# EAGLE design MonitorWizard-Logger (EAGLE 6.6.0)
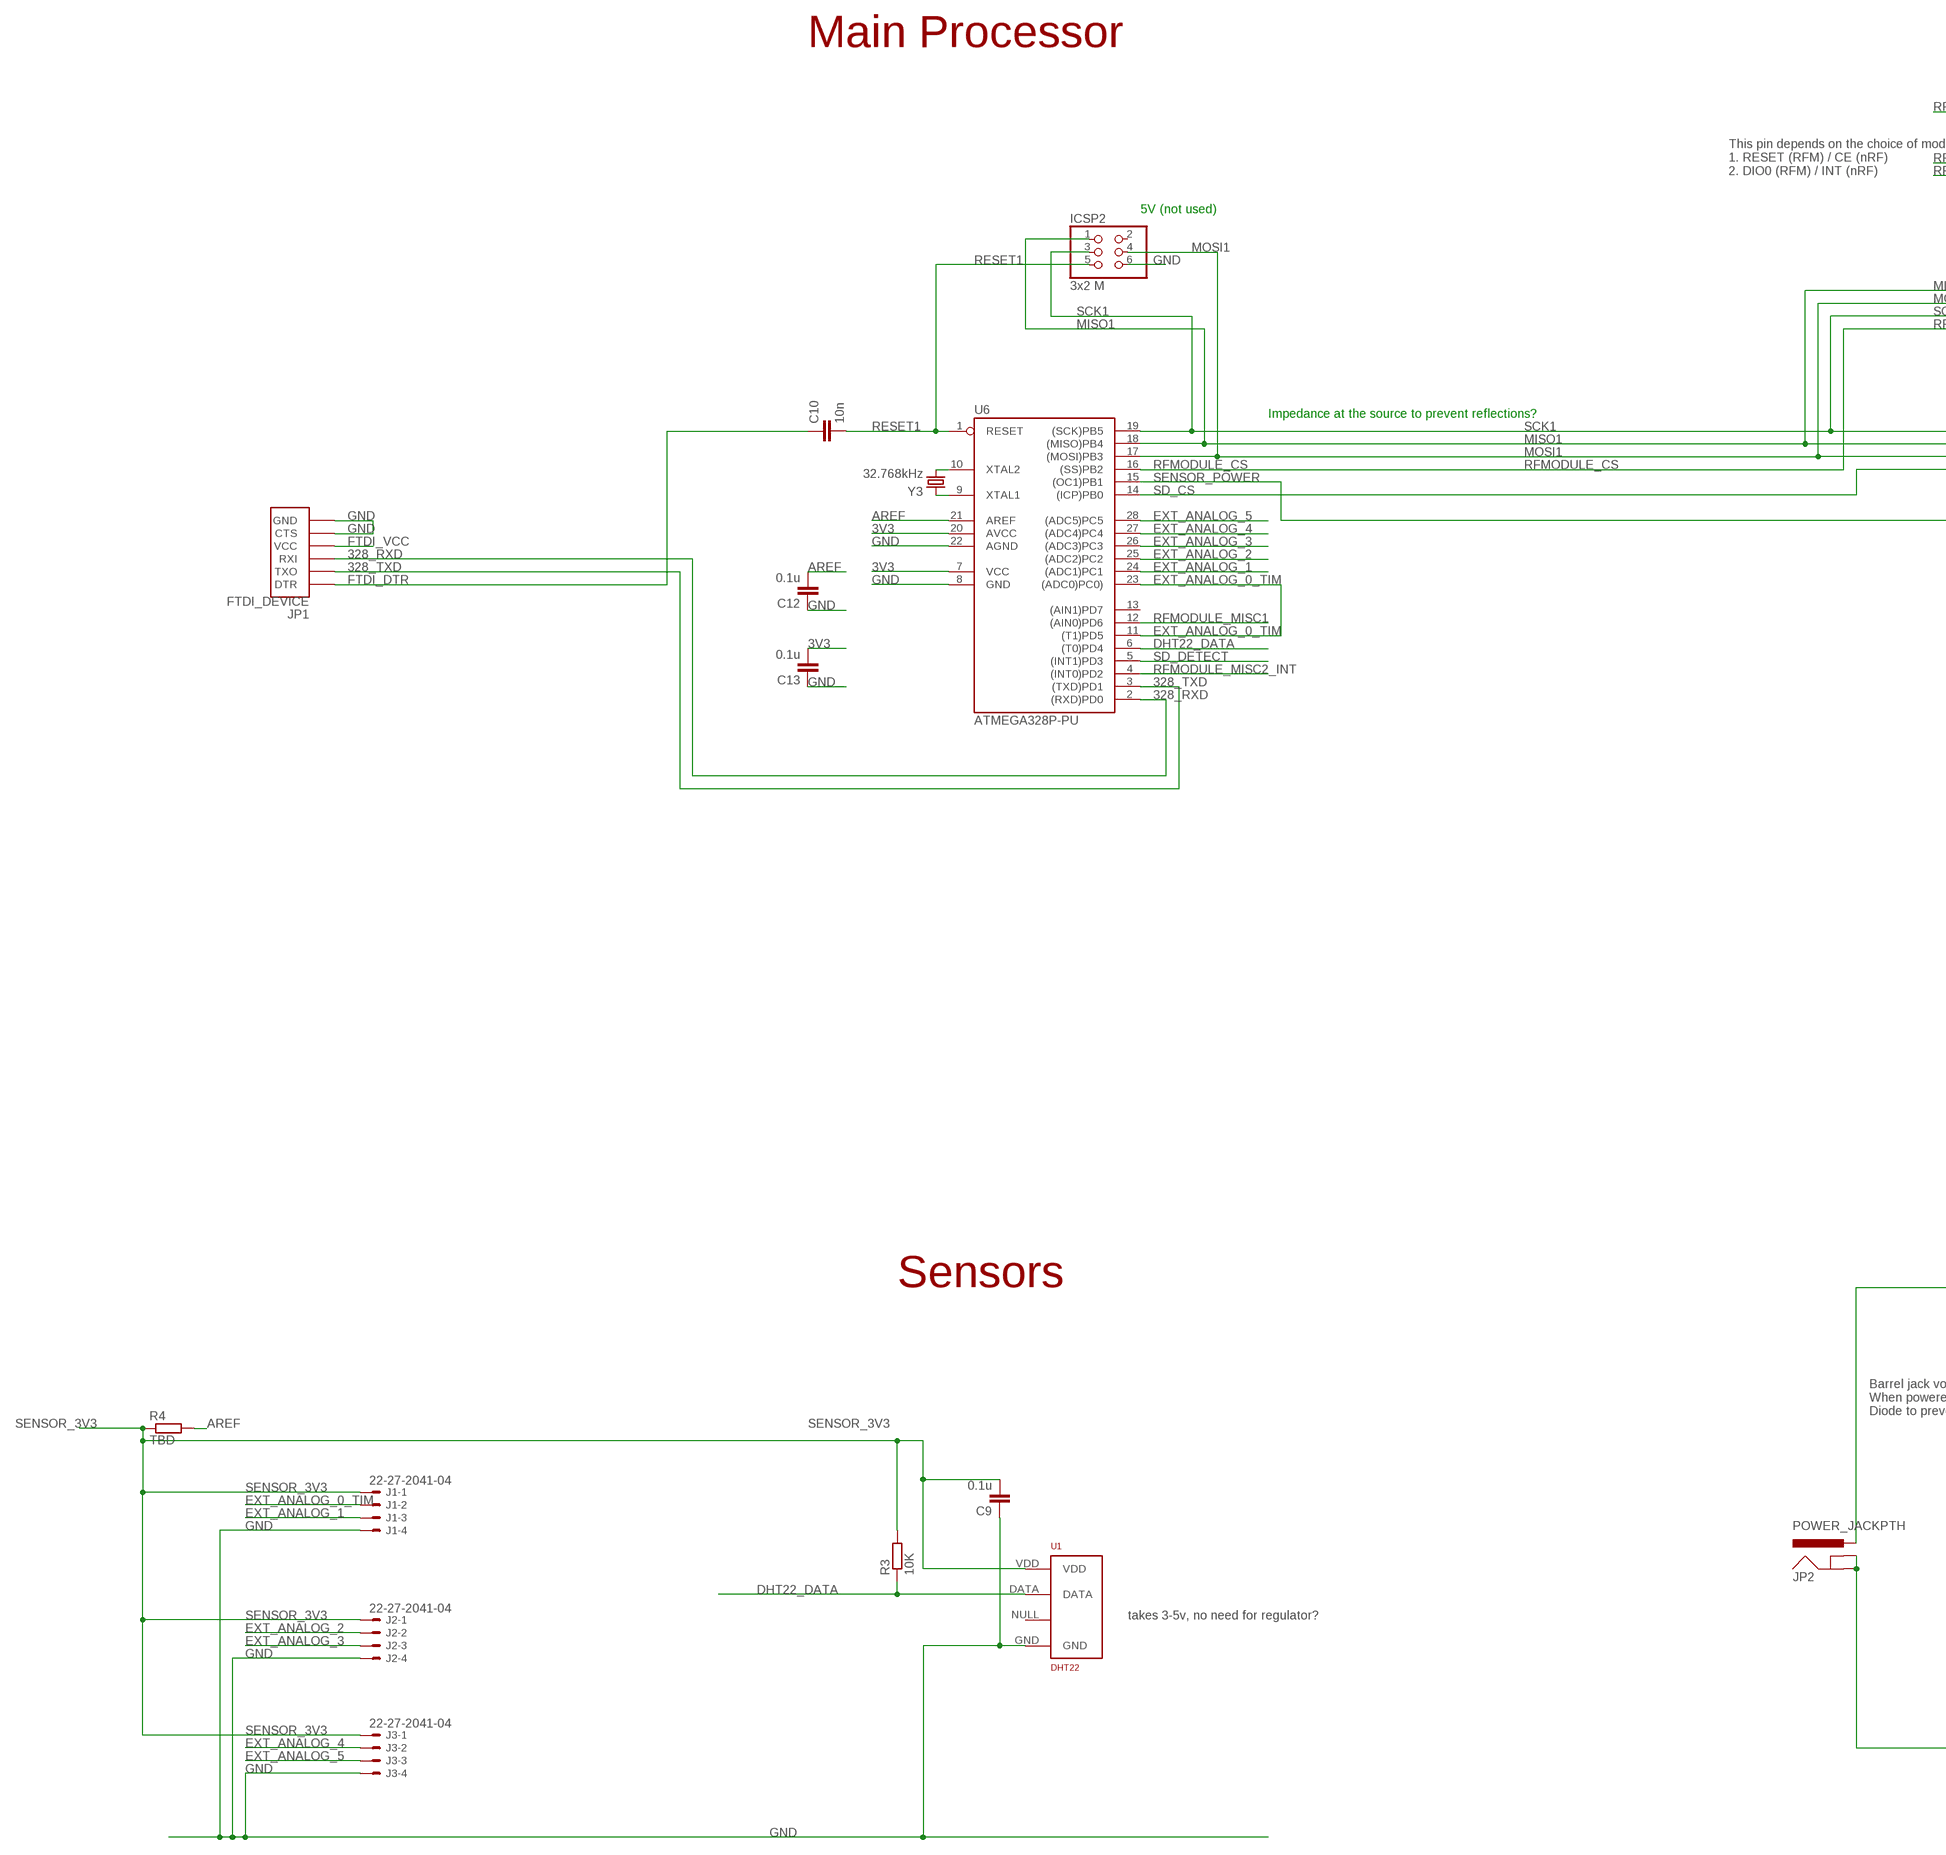
[diagram p0: schematic, sheet 1, part 1 of 2]
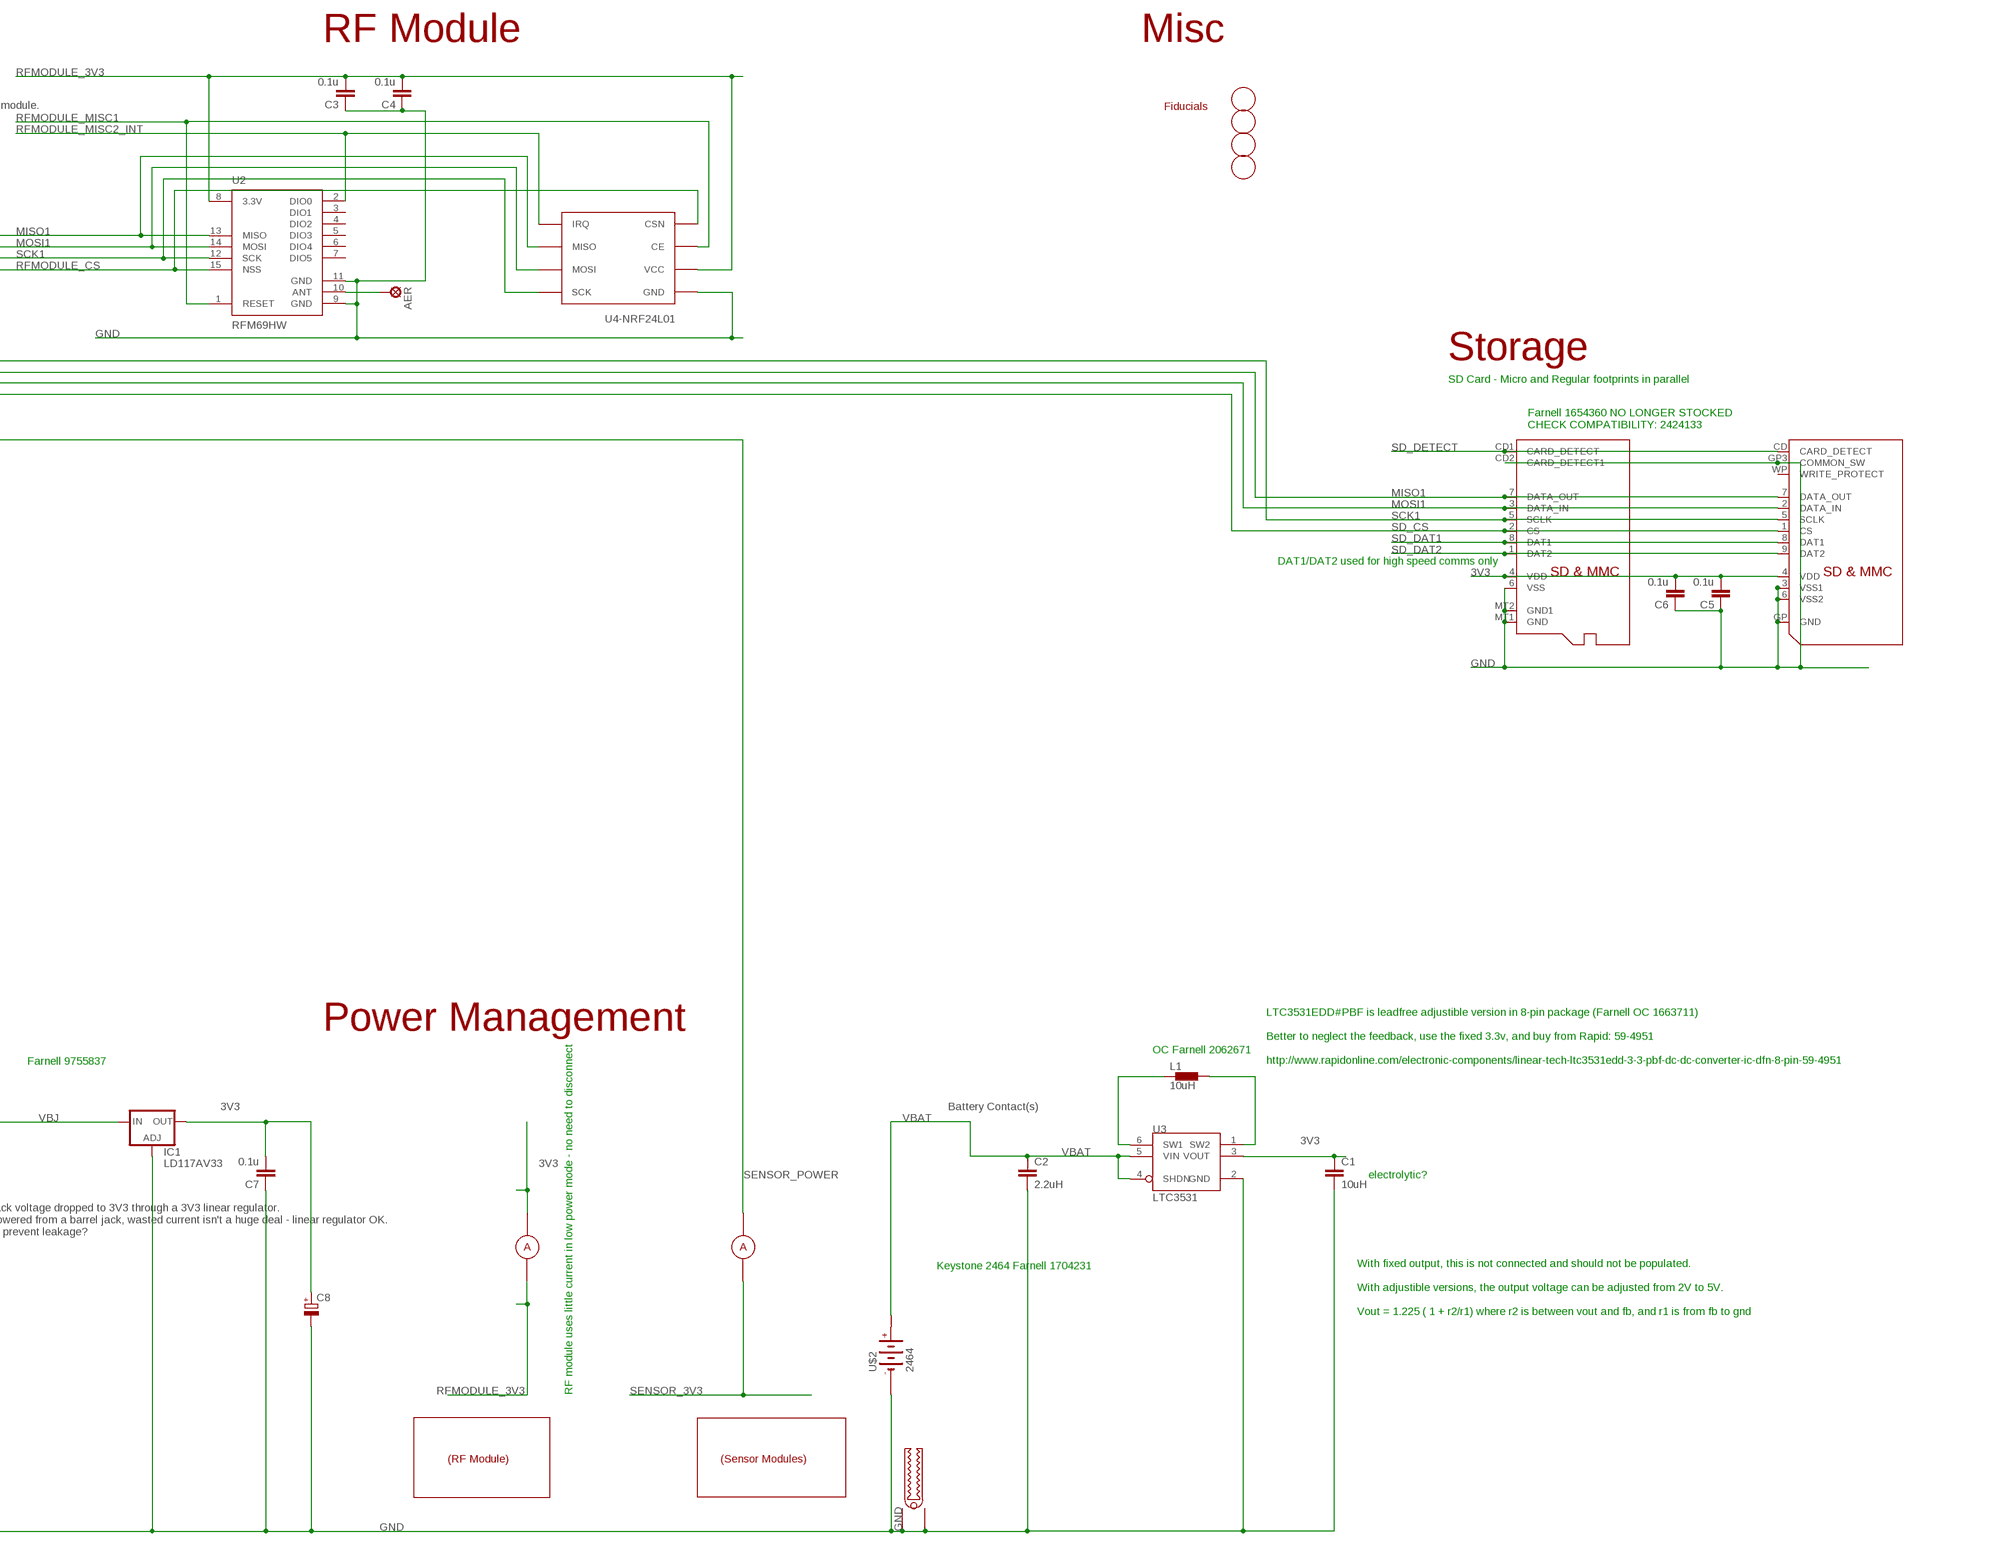
[diagram p1: schematic, sheet 1, part 2 of 2]

## Parts
AER  LSP10  [LSP10]
C1  10uH  C-EU025-024X044  [C025-024X044]
C2  2.2uH  C-EU025-024X044  [C025-024X044]
C3  0.1u  C-EU025-024X044  [C025-024X044]
C4  0.1u  C-EU025-024X044  [C025-024X044]
C5  0.1u  C-EU025-024X044  [C025-024X044]
C6  0.1u  C-EU025-024X044  [C025-024X044]
C7  0.1u  C-EU025-024X044  [C025-024X044]
C8  CPOL-EUE2.5-6  [E2,5-6]
C9  0.1u  C-EU025-024X044  [C025-024X044]
C10  10n  C-EU025-024X044  [C025-024X044]
C12  0.1u  C-EU025-024X044  [C025-024X044]
C13  0.1u  C-EU025-024X044  [C025-024X044]
CON1  MICROSD  [MICROSD]
FD1  FIDUCIALMOUNT  [FIDUCIA-MOUNT]
FD2  FIDUCIALMOUNT  [FIDUCIA-MOUNT]
FD3  FIDUCIALMOUNT  [FIDUCIA-MOUNT]
FD4  FIDUCIALMOUNT  [FIDUCIA-MOUNT]
GND  ALLIGATOR  [ALLIGATOR]
I_RF  CURRENT_MEASURE_0.4A  [CURRENT_MEASURE]
I_SENSE  CURRENT_MEASURE_0.4A  [CURRENT_MEASURE]
IC1  LD117AV33  [TO220L1]
ICSP2  3x2 M  PINHD-2X3  [2X03]
J1  22-27-2041-04  [6410-04]
J2  22-27-2041-04  [6410-04]
J3  22-27-2041-04  [6410-04]
JP1  FTDI_DEVICE  [FTDI_DEVICE_SIDE]
JP2  POWER_JACKPTH  [POWER_JACK_PTH]
L1  10uH  MURATA-1100R  [L-RADIAL-2-5OD]
R3  10K  R-EU_0207/10  [0207/10]
R4  TBD  R-EU_0207/10  [0207/10]
U1  DHT22  RHT03_DHT-22_AM2302  [RHT03_DHT-22]
U2  RFM69HW  [RFM69W-XXXS2]
U3  LTC3531  [TSOT23-6]
U4-NRF24L01  NRF24L01+-PCB-AERIAL  [NRF24L01-PCB-AERIAL]
U6  ATMEGA328P-PU  [DIL28-3]
U$1  SDMMC06132  [06132]
U$2  2464  [2464]
Y3  32.768kHz  CRYSTALTC26H_EZ  [TC26HEZ]

## Nets
3V3: C1.1 C5.2 C6.2 C7.2 C8.+ C13.2 CON1.4(VDD) I_RF.P$1 IC1.2(OUT) U3.3(VOUT) U6.7(VCC) U6.20(AVCC) U$1.4(VDD)
328_RXD: JP1.P$3(RXI) U6.2((RXD)PD0)
328_TXD: JP1.P$2(TXO) U6.3((TXD)PD1)
AREF [aref]: C12.2 R4.2 U6.21(AREF)
DHT22_DATA: R3.1 U1.DATA U6.6((T0)PD4)
EXT_ANALOG_0_TIM: J1.2 U6.11((T1)PD5) U6.23((ADC0)PC0))
EXT_ANALOG_1: J1.3 U6.24((ADC1)PC1)
EXT_ANALOG_2: J2.2 U6.25((ADC2)PC2)
EXT_ANALOG_3: J2.3 U6.26((ADC3)PC3)
EXT_ANALOG_4: J3.2 U6.27((ADC4)PC4)
EXT_ANALOG_5: J3.3 U6.28((ADC5)PC5)
FTDI_DTR: C10.1 JP1.P$1(DTR)
FTDI_VCC: JP1.P$4(VCC)
GND [gnd]: C1.2 C2.2 C3.1 C4.1 C5.1 C6.1 C7.1 C8.- C9.1 C12.1 C13.1 CON1.6(VSS) CON1.CD2(CARD_DETECT1) CON1.MT1(GND) CON1.MT2(GND1) GND.BTM GND.TOP IC1.1(ADJ) ICSP2.6 J1.4 J2.4 J3.4 JP1.P$5(CTS) JP1.P$6(GND) JP2.GND JP2.GNDBREAK U1.GND U2.9(GND) U2.11(GND) U3.2(GND) U4-NRF24L01.P$1(GND) U6.8(GND) U6.22(AGND) U$1.3(VSS1) U$1.6(VSS2) U$1.GP3(COMMON_SW) U$1.GP(GND) U$2.-
MISO1: CON1.7(DATA_OUT) ICSP2.1 U2.13(MISO) U4-NRF24L01.P$7(MISO) U6.18((MISO)PB4) U$1.7(DATA_OUT)
MOSI1: CON1.3(DATA_IN) ICSP2.4 U2.14(MOSI) U4-NRF24L01.P$6(MOSI) U6.17((MOSI)PB3) U$1.2(DATA_IN)
N$1: L1.P$2 U3.1(SW2)
N$2: L1.P$1 U3.6(SW1)
N$9: AER.MP U2.10(ANT)
RESET1: C10.2 ICSP2.5 U6.1(RESET)
RFMODULE_3V3: C3.2 C4.2 I_RF.P$2 U2.8(3.3V) U4-NRF24L01.P$2(VCC)
RFMODULE_CS: U2.15(NSS) U4-NRF24L01.P$4(CSN) U6.16((SS)PB2)
RFMODULE_MISC1: U2.1(RESET) U4-NRF24L01.P$3(CE) U6.12((AIN0)PD6)
RFMODULE_MISC2_INT: U2.2(DIO0) U4-NRF24L01.P$8(IRQ) U6.4((INT0)PD2)
SCK1: CON1.5(SCLK) ICSP2.3 U2.12(SCK) U4-NRF24L01.P$5(SCK) U6.19((SCK)PB5) U$1.5(SCLK)
SD_CS: CON1.2(CS) U6.14((ICP)PB0) U$1.1(CS)
SD_DAT1: CON1.8(DAT1) U$1.8(DAT1)
SD_DAT2: CON1.1(DAT2) U$1.9(DAT2)
SD_DETECT: CON1.CD1(CARD_DETECT) U6.5((INT1)PD3) U$1.CD(CARD_DETECT)
SENSOR_3V3: C9.2 I_SENSE.P$2 J1.1 J2.1 J3.1 R3.2 R4.1 U1.VDD
SENSOR_POWER: I_SENSE.P$1 U6.15((OC1)PB1)
VBAT: C2.1 U3.4(SHDN) U3.5(VIN) U$2.+
VBJ: IC1.3(IN) JP2.PWR
XTAL_N: U6.9(XTAL1) Y3.2
XTAL_P: U6.10(XTAL2) Y3.1
Unconnected: ICSP2.2 U1.NULL U2.3(DIO1) U2.4(DIO2) U2.5(DIO3) U2.6(DIO4) U2.7(DIO5) U6.13((AIN1)PD7) U$1.WP(WRITE_PROTECT)

## Notes on the sheet
- Main Processor
- RF Module | Misc
- Fiducials
- This pin depends on the choice of module. 
  1. RESET (RFM) / CE (nRF)
  2. DIO0 (RFM) / INT (nRF)
- 5V (not used)
- Impedance at the source to prevent reflections?
- Storage
- SD Card - Micro and Regular footprints in parallel
- Farnell 1654360 NO LONGER STOCKED
  CHECK COMPATIBILITY: 2424133
- DAT1/DAT2 used for high speed comms only
- Power Management
- OC Farnell 2062671
- Farnell 9755837
- LTC3531EDD#PBF is leadfree adjustible version in 8-pin package (Farnell OC 1663711)
  
  Better to neglect the feedback, use the fixed 3.3v, and buy from Rapid: 59-4951
  
  http://www.rapidonline.com/electronic-components/linear-tech-ltc3531edd-3-3-pbf-dc-dc-converter-ic-dfn-8-pin-59-4951
- Battery Contact(s)
- Sensors
- electrolytic?
- Barrel jack voltage dropped to 3V3 through a 3V3 linear regulator.
  When powered from a barrel jack, wasted current isn't a huge deal - linear regulator OK.
  Diode to prevent leakage?
- Keystone 2464 Farnell 1704231
- With fixed output, this is not connected and should not be populated.
  
  With adjustible versions, the output voltage can be adjusted from 2V to 5V. 
  
  Vout = 1.225 ( 1 + r2/r1) where r2 is between vout and fb, and r1 is from fb to gnd
- RF module uses little current in low power mode - no need to disconnect
- takes 3-5v, no need for regulator?
- (RF Module) | (Sensor Modules)

## Library data of the parts
AER = solpad:LSP10: SOLDER PAD drill 1.0 mm, distributor Buerklin, 12H555
C1-C7 C9 C10 C12 C13 = rcl:C-EU: CAPACITOR, European symbol
C8 = rcl:CPOL-EU: POLARIZED CAPACITOR, European symbol
CON1 = adafruit:MICROSD: Micro-SD / Transflash card holder with SPI pinout For the 3M # 2908-05WB-MG and/or 4UCON #19656 push-push type
FD1-FD4 = SmartPrj:FIDUCIALMOUNT
GND = Probes:ALLIGATOR
I_RF I_SENSE = Probes:CURRENT_MEASURE: Designed for in-circuit current reading: cut exposed trace and use either an external meter or appropriate shunt resistor to measure current flow. When done, either leave shunt in place, or short pads with solder. Maximum current is about 0.4A for the small link (conservatively).
IC1 = v-reg:LD117A?*: Low drop fixed and adjustable positive voltage regulators 1 A Source: http://www.st.com/stonline/products/literature/ds/7194/ld1117axx.pdf
ICSP2 = SmartPrj:PINHD-2X3: PIN HEADER
J1-J3 = con-molex:22-?-04: CONNECTOR wire to board 2.54 mm (.1 inch) pitch header; OC_FARNELL: unknown; OC_NEWARK: unknown
JP1 = SparkFun-Connectors:FTDI_DEVICE: Connector which mates to FTDI basic or FTDI cable.
JP2 = SparkFun-Connectors:POWER_JACK: Power Jack This is the standard 5.5mm barrel jack for power. The PTH is the most common, proven, reliable, footprint. The Slot footprint only works if the mill layer is transmitted to the PCB fab house so be warned. Mating wall wart : TOL-00298 (and others); PROD_ID: CONN-08197
L1 = InductorsThru:MURATA-1100R
R3 R4 = resistor:R-EU_: RESISTOR, European symbol
U1 = RHT03_DHT-22_AM2302:RHT03_DHT-22_AM2302: RHT03 / DHT-22 / AM2302 Packages and symbol for the RHT03 / DHT-22 relative humidity and temperature sensor. Note: The AM2302 is a wired version of the DHT-22 which typically requires less clearance and is thus provided as a separate package.; PROD_ID: SEN-10167
U2 = SparkFun-RF:RFM69H
U3 = custom:LTC3531
U4-NRF24L01 = Radios:NRF24L01+
U6 = SmartPrj:ATMEGA328P-: MICROCONTROLLER 4 Kbytes FLASH 128 bytes SRAM 256 bytes EEPROM UART 6-channel 10 bit ADC
U$1 = adafruit:SDMMC: SD MMC Card holder 4UCON part #06132 - easy to solder
U$2 = keystone-nodrills:2464
Y3 = SparkFun-FreqCtrl:CRYSTAL: Various standard crystals. Proven footprints. Spark Fun Electronics SKU : COM-00534

## Net classes
0 default: width 0.254 mm, clearance 0.254 mm
1 power: width 0.61 mm, drill 0.61 mm, clearance 0.254 mm
2 gnd: width 0.305 mm, drill 0.559 mm, clearance 0.254 mm
3 usbvcc: width 0.508 mm, drill 0.61 mm, clearance 0.254 mm
4 aref: width 0.406 mm, drill 0.61 mm, clearance 0.254 mm

## Board
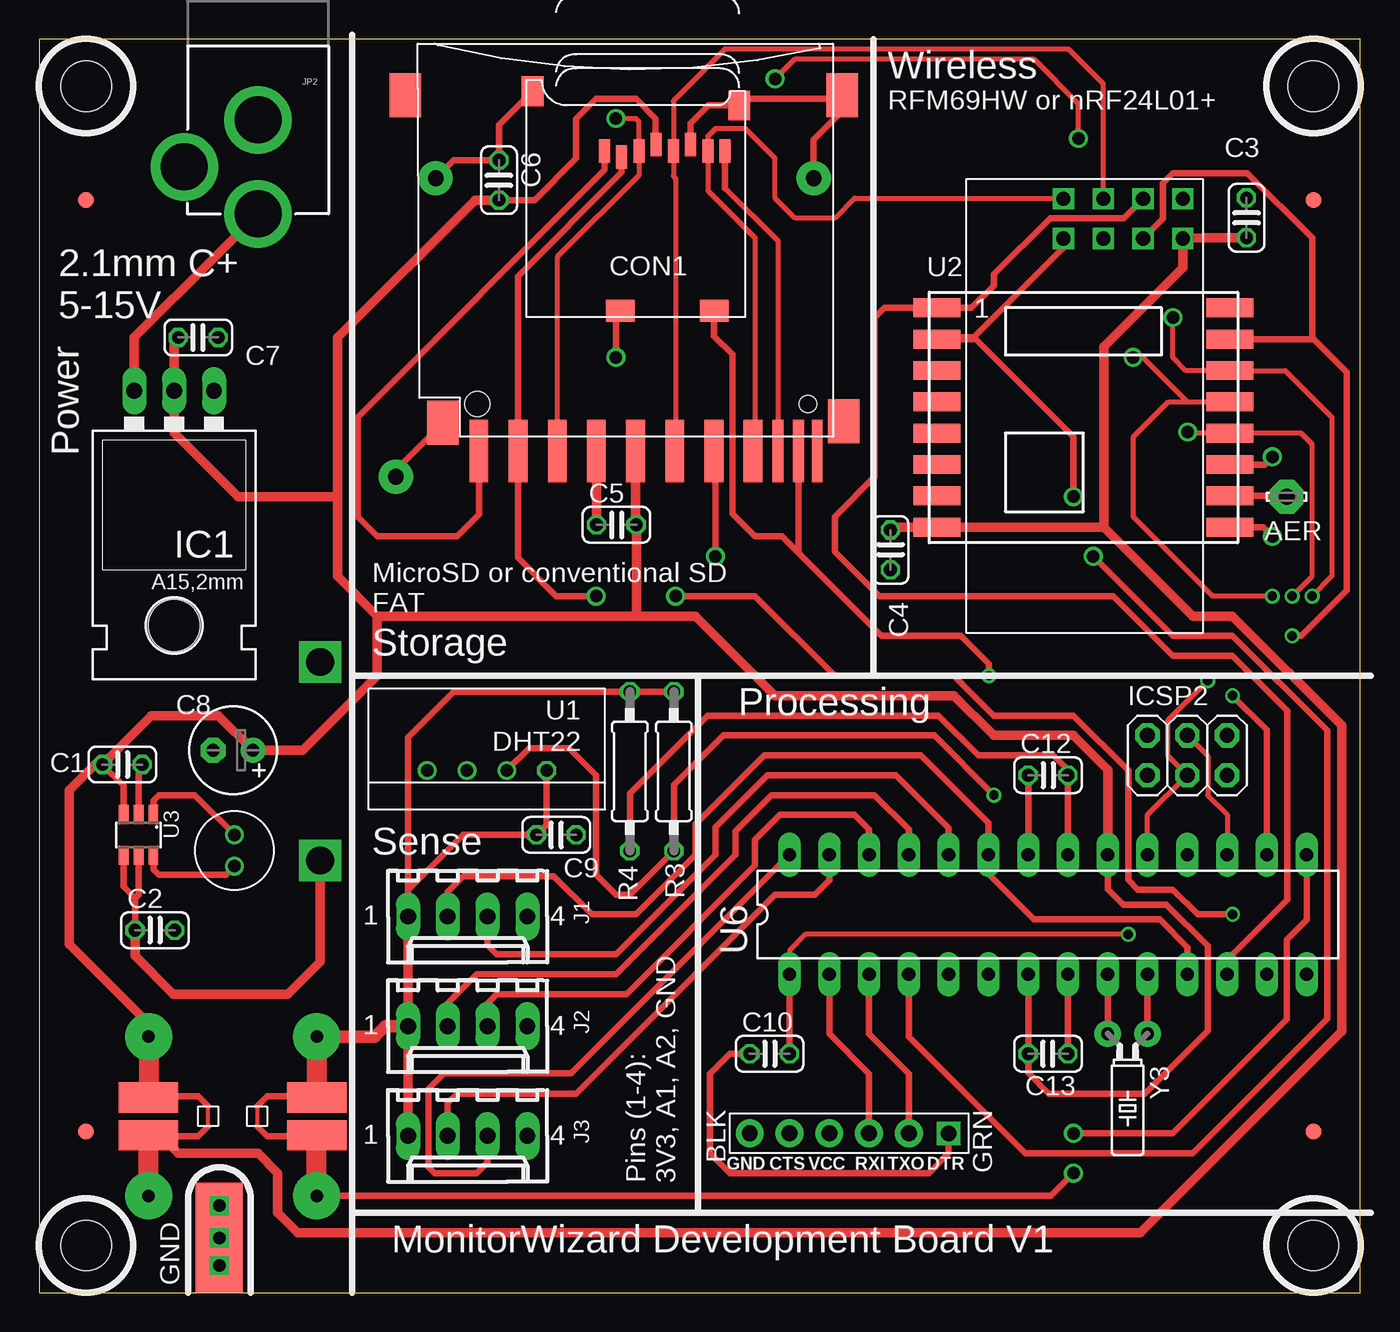
[diagram p2: board, top side]
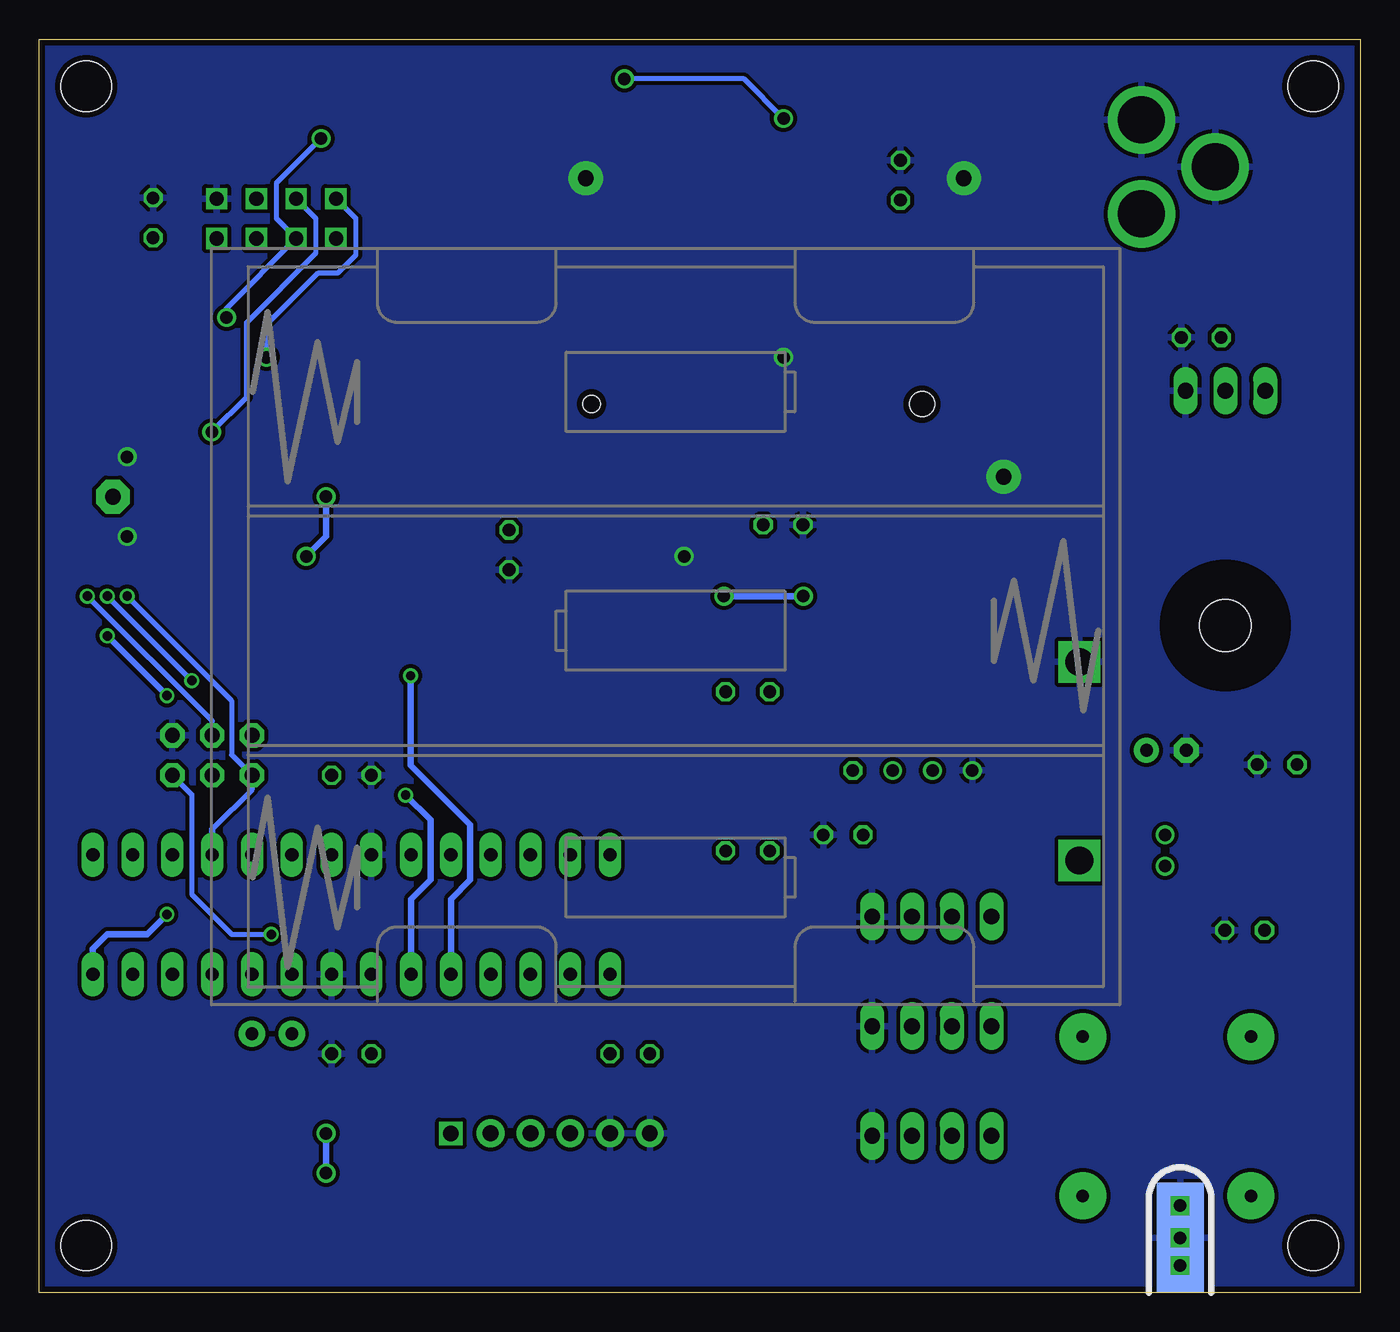
[diagram p3: board, bottom side, seen from below]

Size 84.36 x 80 mm. Coordinates in mm from the lower left corner, seen from the top.
Outline: 0,0 84.36,0 84.36,80 0,80 0,0
Copper layers (1*16): Top 0.0356mm / dielectric 1.5011mm / Bottom 0.0356mm
Design rules "LaenPCBOrder": minimum track width 6mil, minimum drill 13mil, track to track 6mil, track to pad 6mil, pad to pad 6mil, via to via 6mil, smd to smd 6mil, copper to edge 15mil, drill to drill 6mil, minimum pad ring 7mil, minimum via ring 7mil, stop-mask expansion 3mil, vias tented up to drill 0mil, thermal gap 10mil
Holes 3.2 mm at 3,77 3,3 81.36,3 81.36,77

### Footprints (pad centres in the part's own frame; a part is rotated, then mirrored left to right if it is on the bottom)
LSP10 = drill 1.016 pad 2.159 octagon: MP 0,0
C025-024X044 = drill 0.813 octagon: 1 -1.27,0; 2 1.27,0
E2,5-6 = drill 0.813 pad 1.6: + -1.27,0 | drill 0.813 pad 1.6 octagon: - 1.27,0
MICROSD = smd 0.7 x 1.5: 1 9,-10.64; 2 7.9,-10.24; 3 6.8,-10.64; 4 5.7,-11.04; 5 4.6,-10.64; 6 3.5,-11.04; 7 2.4,-10.64; 8 1.3,-10.64 | smd 1.8 x 1.4: CD1 2,-0.44; CD2 8,-0.44 | smd 1.4 x 1.9: MT1 0.4,-13.54; MT2 13.6,-14.44
FIDUCIA-MOUNT = smd 1.016 x 1.016: P$1 0,0
ALLIGATOR = smd 3 x 7 bottom: BTM 0,3.5 | drill 0.8 square: P$1 0,5.54; P$4 0,1.73 | smd 3 x 7: TOP 0,3.5
CURRENT_MEASURE = drill 0.8 pad 3: P$1 0,5.08; P$2 0,-5.08 | smd 3.81 x 1.93: RPAD1 0,1.204; RPAD2 0,-1.204
TO220L1 = drill 1.016 long: 1 -2.54,-3.81; 2 0,-3.81; 3 2.54,-3.81 | hole 3.302: 0,11.176
2X03 = drill 0.95 pad 1.55 octagon: 1 -2.54,-1.27; 2 -2.54,1.27; 3 0,-1.27; 4 0,1.27; 5 2.54,-1.27; 6 2.54,1.27
6410-04 = drill 1.016 long: 1 3.81,0; 2 1.27,0; 3 -1.27,0; 4 -3.81,0
FTDI_DEVICE_SIDE = drill 1 square: P$1 -6.35,0 | drill 1.016 pad 1.778: P$2 -3.81,0; P$3 -1.27,0; P$4 1.27,0; P$5 3.81,0; P$6 6.35,0
POWER_JACK_PTH = drill 2.997 pad 4.318: GND 0,7.7; GNDBREAK 4.7,10.7; PWR 0,13.7
L-RADIAL-2-5OD = drill 0.8: P$1 -1,0; P$2 1,0
0207/10 = drill 0.813 octagon: 1 -5.08,0; 2 5.08,0
RHT03_DHT-22 = drill 0.8: DATA -1.27,0; GND 3.81,0; NULL 1.27,0 | drill 0.8 octagon: VDD -3.81,0
RFM69W-XXXS2 = smd 3 x 1.2: 1 -9.35,7; 2 -9.35,5; 3 -9.35,3; 4 -9.35,1; 5 -9.35,-1; 6 -9.35,-3; 7 -9.35,-5; 8 -9.35,-7; 9 9.35,-7; 10 9.35,-5; 11 9.35,-3; 12 9.35,-1; 13 9.35,1; 14 9.35,3; 15 9.35,5; 16 9.35,7
TSOT23-6 = smd 0.62 x 1.22: 1 -0.95,-1.3; 2 0,-1.3; 3 0.95,-1.3; 4 0.95,1.3; 5 0,1.3; 6 -0.95,1.3
NRF24L01-PCB-AERIAL = drill 0.9 square: P$1 -3.81,-1.27; P$2 -3.81,1.27; P$3 -1.27,-1.27; P$4 -1.27,1.27; P$5 1.27,-1.27; P$6 1.27,1.27; P$7 3.81,-1.27; P$8 3.81,1.27
DIL28-3 = drill 0.85 pad 1.422 long: 1 -16.51,-3.81; 2 -13.97,-3.81; 3 -11.43,-3.81; 4 -8.89,-3.81; 5 -6.35,-3.81; 6 -3.81,-3.81; 7 -1.27,-3.81; 8 1.27,-3.81; 9 3.81,-3.81; 10 6.35,-3.81; 11 8.89,-3.81; 12 11.43,-3.81; 13 13.97,-3.81; 14 16.51,-3.81; 15 16.51,3.81; 16 13.97,3.81; 17 11.43,3.81; 18 8.89,3.81; 19 6.35,3.81; 20 3.81,3.81; 21 1.27,3.81; 22 -1.27,3.81; 23 -3.81,3.81; 24 -6.35,3.81; 25 -8.89,3.81; 26 -11.43,3.81; 27 -13.97,3.81; 28 -16.51,3.81
06132 = smd 1.2 x 4: 1 6.9,0.9; 2 4.4,0.9; 3 1.9,0.9; 4 -0.6,0.9; 5 -3.1,0.9; 6 -5.6,0.9; 7 -8.1,0.9; 9 9.4,0.9 | smd 0.7 x 4: 8 -9.7,0.9; CD -11,0.9; WP -12.2,0.9 | smd 2 x 2.8: GP -13.8,-21.8; GP2 14.1,-21.8; GP3 11.7,-0.9; GP4 -13.9,-1 | hole 1.1: -11.6,-2.1 | hole 1.6: 9.5,-2.1
2464 = drill 1.778 square: + 26.42,-14.925; - 26.42,-2.25
TC26HEZ = drill 0.813 pad 1.676: 1 -1.27,0; 2 1.27,0

### Placement (x,y rotation side)
AER  79.65,50.8 180 top
C1  5.31,33.7 0 top
C2  7.39,23.13 0 top
C3  77.09,68.6 270 top
C4  54.36,47.4 90 top
C5  36.86,49 0 top
C6  29.36,71 270 top
C7  10.16,60.96 180 top
C8  12.38,34.61 180 top
C9  33.02,29.21 180 top
C10  46.64,15.24 0 top
C12  64.42,33.02 0 top
C13  64.42,15.24 180 top
CON1  45.1,62.23 180 top
FD1  81.36,69.73 0 top
FD2  3,69.73 0 top
FD3  3,10.27 0 top
FD4  81.36,10.27 0 top
GND  11.51,0 0 top
I_RF  6.98,11.25 0 top
I_SENSE  17.73,11.25 180 top
IC1  8.62,53.75 180 top
ICSP2  73.31,34.29 0 top
J1  27.36,24 180 top
J2  27.36,17 180 top
J3  27.36,10 180 top
JP1  51.72,10.16 180 top
JP2  13.97,82.55 180 top
L1  12.47,28.21 90 top
R3  40.52,33.27 90 top
R4  37.72,33.27 270 top
U1  28.59,33.32 180 top
U2  66.68,55.85 0 top
U3  6.35,29.21 180 top
U4-NRF24L01  69.22,68.55 180 top
U6  64.42,24.13 0 top
U$1  37.48,54.61 180 top
U$2  44.36,42.5 0 bottom
Y3  69.5,16.51 180 top

### Tracks (layer width: path | path; a pad name or v marks a point on that pad's centre or on a via)
3V3
  Top 0.406: U6.7 C13.2 63.15,14.02 64.47,12.7 70.59,12.7 74.61,16.72 74.61,22.13 71.98,24.77 69.22,24.77 68.23,25.75 U6.20 | CON1.4 39.37,73.3 39.37,74.93 38.1,76.2 35.56,76.2 34.29,74.93 34.29,72.39 31.63,69.73 C6.2 | U3.3 5.4,32.34 C1.1
  Top 0.61: U$1.4 38.08,49.05 C5.2 38.13,43.21 | 19.05,50.8 19.05,45.72 21.59,43.18 | 19.05,50.8 19.05,60.96 27.82,69.73 C6.2 | 38.13,43.21 38.1,43.18 21.59,43.18 | U6.20 68.23,33.37 66.04,35.56 60.96,35.56 58.42,38.1 46.99,38.1 41.91,43.18 38.16,43.18 38.13,43.21 | 19.05,50.8 12.7,50.8 8.62,54.88 IC1.2 8.62,60.69 C7.2 | 21.59,43.18 21.59,39.37 16.83,34.61 C8.+ 11.43,36.83 7.17,36.83 C1.1 3.54,33.7 1.91,32.07 1.91,22.23 6.98,17.14 I_RF.P$1
328_RXD
  Top 0.406: U6.2 50.45,16.51 52.99,13.97 JP1.P$3
328_TXD
  Top 0.406: U6.3 52.99,16.51 55.53,13.97 JP1.P$2
AREF
  Top 0.406: U6.21 C12.2 65.69,33.37 64.77,34.29 59.96,34.29 57.42,36.83 42.68,36.83 37.72,31.86 R4.2
DHT22_DATA  (via drill 0.6)
  Top 0.406: v60.96,31.75 57.15,35.56 43.68,35.56 40.52,32.41 R3.1 37.73,25.4 36.83,25.4 35.56,26.67 35.56,33.02 33.83,34.75 31.29,34.75 U1.DATA
  Bottom 0.406: U6.6 60.61,25.11 59.37,26.35 59.37,30.16 v60.96,31.75
EXT_ANALOG_0_TIM
  Top 0.406: J1.2 26.09,25.57 27.08,26.56 32.86,26.56 35.29,24.13 38.1,24.13 41.91,27.94 41.91,29.88 46.32,34.29 56.32,34.29 60.61,30 U6.23 60.61,26.72 63.51,23.81 71.54,23.81 73.31,22.05 U6.11
EXT_ANALOG_1
  Top 0.406: U6.24 58.07,29.67 54.72,33.02 46.49,33.02 43.18,29.71 43.18,27.94 36.83,21.59 29.21,21.59 28.63,22.17 J1.3
EXT_ANALOG_2
  Top 0.406: J2.2 26.09,18.47 27.94,20.32 36.83,20.32 44.45,27.94 44.45,29.43 46.77,31.75 53.34,31.75 55.53,29.56 U6.25
EXT_ANALOG_3
  Top 0.406: J2.3 28.63,18.47 29.21,19.05 37.5,19.05 45.72,27.27 45.72,28.91 47.29,30.48 52.07,30.48 52.99,29.56 U6.26
EXT_ANALOG_4
  Top 0.406: U6.27 50.45,26.32 49.53,25.4 46.99,25.4 34.29,12.7 26.67,12.7 26.09,12.12 J3.2
EXT_ANALOG_5
  Top 0.406: J3.3 28.63,8.31 27.94,7.62 25.24,7.62 24.86,8 24.86,13 25.86,14 33.97,14 U6.28
FTDI_DTR
  Top 0.406: C10.1 44.1,15.24 42.83,13.97 42.83,8.89 44.1,7.62 56.8,7.62 58.07,8.89 JP1.P$1
GND  (via drill 0.8, 1 pad 2.18)
  Top 0.406: C13.1 U6.8 | C12.1 U6.22 | CON1.6 41.6,74.62 42.75,75.77 CON1.MT1 45.13,76.2 52.07,76.2 | 52.07,76.2 49.45,73.58 v49.45,71.12 | CON1.MT2 29.36,74.53 C6.1 26.47,72.27 v25.32,71.12 | U$1.GP3 22.78,52.51 v22.78,52.07 | U$1.6 43.18,53.61 v43.18,46.99 | CON1.CD2 36.83,62.4 v36.83,59.69 | U2.11 78.25,52.85 v78.74,53.34 | U2.9 78.15,48.85 v78.74,48.26 | U$1.GP 51.86,76.41 52.07,76.2 | U3.2 6.35,33.47 C1.2
  Top 0.61: C5.1 U$1.3 | GND.BTM 11.82,3.81 v11.51,3.49
  Bottom 0.61: v11.51,3.49 12.39,3.5 GND.BTM
  pour Bottom (rank 5): 0,0 84.36,0 84.36,80 0,80
MISO1  (via drill 0.6, 0.8)
  Top 0.305: 45.72,53.34 45.72,67.31 42.7,70.33 CON1.7 42.7,73.81 43.18,74.3 45.09,74.3 46.99,72.39 46.99,69.85 48.26,68.58 50.8,68.58 52.07,69.85 52.1,69.82 U4-NRF24L01.P$7 | v78.74,44.45 74.93,44.45 69.85,49.53 69.85,54.61 72.09,56.85 73.32,56.85 | 73.32,56.85 U2.13 | v69.85,59.69 70.49,59.69 73.32,56.85
  Top 0.406: 45.72,53.34 45.58,53.48 U$1.7
  Bottom 0.305: 73.31,29.56 70.77,32.1 ICSP2.1 72.07,34.32 72.07,37.78 v78.74,44.45 | U4-NRF24L01.P$7 64.13,68.55 64.13,66.23 65.28,65.09 66.53,65.09 69.85,61.77 v69.85,59.69
  Bottom 0.406: 73.31,29.56 U6.18
MOSI1  (via drill 0.6, 0.8)
  Top 0.305: ICSP2.4 74.61,34.26 74.61,31.75 75.85,30.51 U6.17 | U$1.2 33.08,66.1 38.3,71.32 CON1.3 38.3,74.73 38.1,74.93 v36.83,74.93 | v81.28,44.45 82.55,45.72 82.55,55.88 79.58,58.85 U2.14 73.23,58.85 72.39,59.69 v72.39,62.23 | v46.99,77.47 48.26,78.74 63.5,78.74 66.36,75.88 v66.36,73.66
  Bottom 0.305: ICSP2.4 73.31,36.48 v81.28,44.45 | v36.83,74.93 39.37,77.47 v46.99,77.47 | v72.39,62.23 72.39,62.84 U4-NRF24L01.P$6 69.22,68.56 69.22,70.8 v66.36,73.66
N$1
  Top 0.406: U3.1 7.3,31.43 7.62,31.75 9.93,31.75 L1.P$2
N$2
  Top 0.406: U3.6 7.3,26.99 7.62,26.67 11.93,26.67 L1.P$1
N$9
  Top 0.406: U2.10 79.6,50.85 AER.MP
RESET1  (via drill 0.6)
  Top 0.305: v69.53,22.86 48.91,22.86 47.91,21.86 U6.1
  Top 0.406: U6.1 C10.2
  Bottom 0.305: ICSP2.5 74.61,31.78 74.61,25.42 72.05,22.86 v69.53,22.86
RFMODULE_3V3
  Top 0.61: C3.2 74.35,67.33 U4-NRF24L01.P$2 73.03,65.41 67.99,60.37 67.99,48.85 | C4.2 54.54,48.85 U2.8 67.99,48.85 | 67.99,48.85 73.66,43.18 76.2,43.18 83.19,36.2 83.19,16.68 70.32,3.81 16.51,3.81 15.24,5.08 15.24,7.62 13.97,8.89 8.89,8.89 7.62,10.16 6.98,9.53 I_RF.P$2
RFMODULE_CS  (via drill 0.6)
  Top 0.406: U6.16 78.39,35.91 v76.2,38.1 | v80.01,41.91 80.57,41.91 83.5,44.84 83.5,58.74 81.39,60.85 81.17,60.85 | U2.15 81.17,60.85 | 81.17,60.85 81.28,60.96 81.28,67.31 77.15,71.44 72.39,71.44 71.75,70.8 71.75,68.55 U4-NRF24L01.P$4
  Bottom 0.406: v76.2,38.1 v80.01,41.91
RFMODULE_MISC1
  Top 0.406: U6.12 75.85,21.24 79.69,25.08 79.69,37.15 76.2,40.64 72.39,40.64 68.58,44.45 53.64,44.45 50.8,47.29 50.8,49.53 53.34,52.07 53.34,62.23 53.96,62.85 U2.1 59.53,62.85 60.96,64.28 60.96,64.99 64.55,68.58 69.25,68.58 U4-NRF24L01.P$3
RFMODULE_MISC2_INT  (via drill 0.8)
  Top 0.406: U6.4 55.53,16.33 62.97,8.89 73.66,8.89 82.23,17.46 82.23,35.88 76.2,41.91 72.39,41.91 v67.31,46.99 | 59.69,60.96 59.58,60.85 U2.2 57.44,60.96 59.69,60.96 | 59.69,60.96 65.41,66.68 U4-NRF24L01.P$8 | 59.69,60.96 66.04,54.61 v66.04,50.8
  Bottom 0.406: v66.04,50.8 66.04,48.26 v67.31,46.99
SCK1  (via drill 0.6, 0.8)
  Top 0.305: U6.19 70.77,30.48 ICSP2.3 72.07,34.26 72.07,36.51 v74.61,39.05 | 40.64,53.77 40.64,71.12 40.5,71.26 CON1.5 40.5,76.06 43.81,79.38 65.72,79.38 67.95,77.15 U4-NRF24L01.P$5 | v80.01,44.45 81.28,45.72 81.28,54.15 80.58,54.85 U2.12 73.42,54.85 v73.34,54.93
  Top 0.406: 40.64,53.77 U$1.5
  Bottom 0.305: v74.61,39.05 v80.01,44.45 | v73.34,54.93 71.12,57.15 71.12,61.91 66.68,66.36 66.68,68.55 U4-NRF24L01.P$5
SD_CS  (via drill 0.6, 0.8)
  Top 0.406: v76.2,24.13 73.98,24.13 72.39,25.72 70.17,25.72 69.53,26.35 69.53,33.34 66.04,36.83 60.96,36.83 58.42,39.37 50.8,39.37 45.72,44.45 v40.64,44.45 | CON1.2 37.2,71.49 30.58,64.87 U$1.1 30.58,46.89 33.02,44.45 v35.56,44.45
  Bottom 0.406: U6.14 80.93,21.94 80.01,22.86 77.47,22.86 v76.2,24.13 | v40.64,44.45 v35.56,44.45
SD_DAT1
  Top 0.305: 43.8,70.5 47.18,67.12 U$1.8
  Top 0.406: CON1.8 43.8,70.5
SD_DAT2
  Top 0.406: CON1.1 36.1,71.66 20.32,55.88 20.32,49.53 21.59,48.26 26.67,48.26 28.08,49.67 U$1.9
SD_DETECT  (via drill 0.6)
  Top 0.406: v60.64,39.37 60.64,40.13 58.86,41.91 53.78,41.91 48.48,47.21 | U$1.CD 48.48,47.21 | CON1.CD1 43.1,61.04 44.26,59.88 44.26,49.72 45.72,48.26 47.43,48.26 48.48,47.21
  Bottom 0.406: U6.5 58.07,25.11 56.83,26.35 56.83,29.84 60.64,33.66 v60.64,39.37
SENSOR_3V3
  Top 0.406: R3.2 R4.1 26.47,38.35 23.55,35.43 J1.1 23.55,25.7 27.06,29.21 C9.2 32.4,29.86 U1.VDD
  Top 0.61: J1.1 J2.1 J3.1
  Top 0.813: J2.1 22.08,17 21.41,16.33 I_SENSE.P$2
SENSOR_POWER  (via drill 0.8)
  Top 0.406: U6.15 80.93,23.78 79.66,22.51 79.66,17.43 72.39,10.16 v66.04,10.16 | v66.04,7.62 64.59,6.17 I_SENSE.P$1
  Bottom 0.406: v66.04,10.16 v66.04,7.62
VBAT
  Top 0.406: U3.5 6.35,25.4 6.12,25.17 | 6.12,25.17 C2.1 | U3.4 5.4,25.89 6.12,25.17
  Top 0.61: U$2.+ 17.94,21.11 15.88,19.05 8.57,19.05 6.12,21.5 C2.1
VBJ
  Top 0.61: IC1.3 6.08,60.96 11.16,66.04 JP2.PWR
XTAL_N
  Top 0.406: Y3.2 U6.9
XTAL_P
  Top 0.406: Y3.1 U6.10

### Text on the board
tPlace: Wireless | 2.1mm C+ / 5-15V | Power | Processing | Sense | Pins (1-4): / 3V3, A1, A2, GND | MonitorWizard Development Board V1
tNames: RFM69HW or nRF24L01+ | MicroSD or conventional SD / FAT | Storage